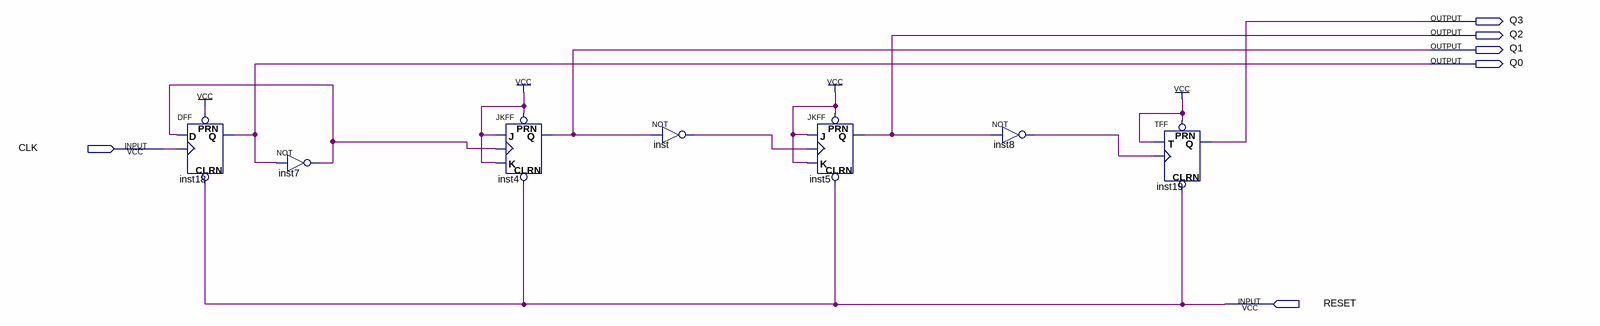
[diagram p0: schematic sheet]
// Quartus schematic counter.bdf as structural Verilog: 7 symbols, 6 pins
module counter (
  input  CLK,
  input  RESET,
  output Q3,
  output Q2,
  output Q1,
  output Q0
);

  wire inst7_out, inst8_out, inst_out;

  DFF inst18 (.CLRN(RESET), .CLK(CLK), .D(inst7_out), .PRN(1'b1), .Q(Q0));
  not inst7 (inst7_out, Q0);
  JKFF inst4 (.PRN(1'b1), .CLRN(RESET), .K(1'b1), .J(1'b1), .CLK(inst7_out), .Q(Q1));
  not inst (inst_out, Q1);
  JKFF inst5 (.PRN(1'b1), .CLRN(RESET), .K(1'b1), .J(1'b1), .CLK(inst_out), .Q(Q2));
  not inst8 (inst8_out, Q2);
  TFF inst19 (.PRN(1'b1), .CLRN(RESET), .T(1'b1), .CLK(inst8_out), .Q(Q3));
endmodule
